# Altium schematic sheet Tone_Control_Block.SchDoc
size A4; SheetNumber: 8; SheetTotal: 8
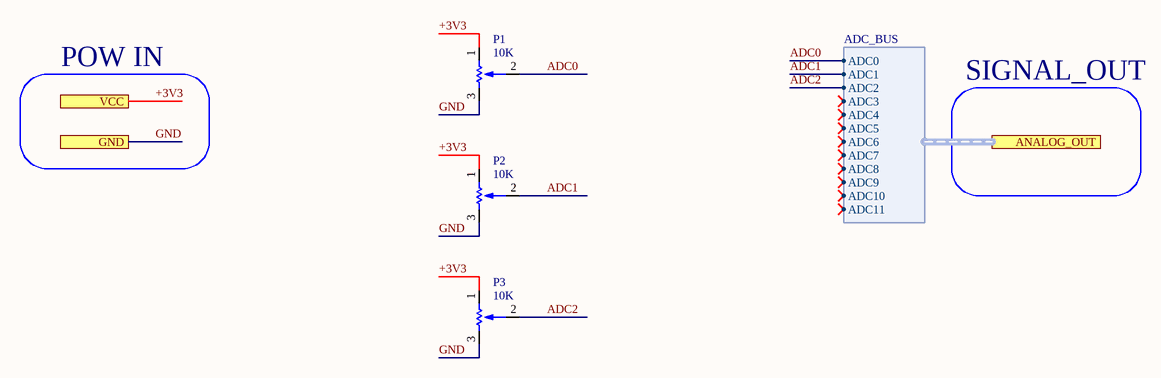
[diagram p0: Tone_Control_Block.SchDoc]

## Parts
P1  10K  [POT-THT]
P2  10K  [POT-THT]
P3  10K  [POT-THT]

## Ports
ANALOG_OUT (harness ADC_BUS), GND, VCC

## Harnesses
ADC_BUS: ADC0, ADC1, ADC2, ADC3, ADC4, ADC5, ADC6, ADC7, ADC8, ADC9, ADC10, ADC11

## Nets
+3V3: P1.1 P2.1 P3.1 ; port VCC
ADC0: P1.2 ; port ANALOG_OUT.ADC0
ADC1: P2.2 ; port ANALOG_OUT.ADC1
ADC2: P3.2 ; port ANALOG_OUT.ADC2
GND: P1.3 P2.3 P3.3 ; port GND

## Notes on the sheet
- POW IN
- SIGNAL_OUT

## Library data of the parts
P1-P3 = POT-THT